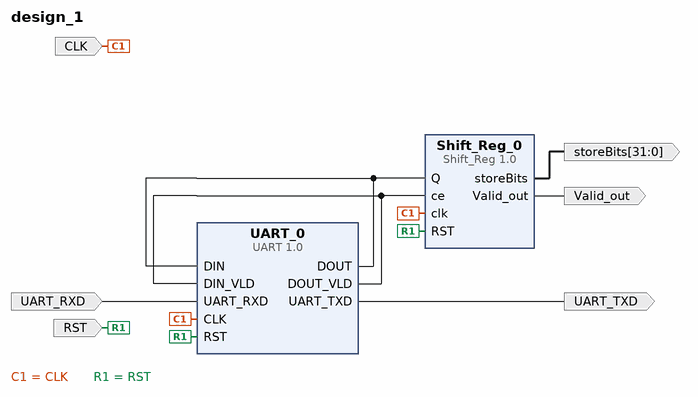
[diagram p0: block diagram of the top level]
# Vivado block design design_1, Vivado 2015.3
create_bd_design design_1

create_bd_port -dir I -type clk CLK
create_bd_port -dir I -type rst RST
create_bd_port -dir I UART_RXD
create_bd_port -dir O UART_TXD
create_bd_port -dir O Valid_out
create_bd_port -dir O -from 31 -to 0 storeBits

create_bd_cell -type ip -vlnv xilinx.com:user:UART:1.0 UART_0
create_bd_cell -type ip -vlnv xilinx.com:user:Shift_Reg:1.0 Shift_Reg_0

# ---- connections ----

connect_bd_net [get_bd_ports CLK] [get_bd_pins UART_0/CLK] [get_bd_pins Shift_Reg_0/clk]
connect_bd_net [get_bd_ports RST] [get_bd_pins UART_0/RST] [get_bd_pins Shift_Reg_0/RST]
connect_bd_net [get_bd_ports UART_RXD] [get_bd_pins UART_0/UART_RXD]
connect_bd_net [get_bd_pins UART_0/UART_TXD] [get_bd_ports UART_TXD]
connect_bd_net [get_bd_pins UART_0/DOUT] [get_bd_pins Shift_Reg_0/Q] [get_bd_pins UART_0/DIN]
connect_bd_net [get_bd_pins UART_0/DOUT_VLD] [get_bd_pins Shift_Reg_0/ce] [get_bd_pins UART_0/DIN_VLD]
connect_bd_net [get_bd_pins Shift_Reg_0/Valid_out] [get_bd_ports Valid_out]
connect_bd_net [get_bd_pins Shift_Reg_0/storeBits] [get_bd_ports storeBits]

validate_bd_design
save_bd_design
